# Altium schematic sheet Sheet1.SchDoc
size A2; SheetNumber: 1; SheetTotal: 1
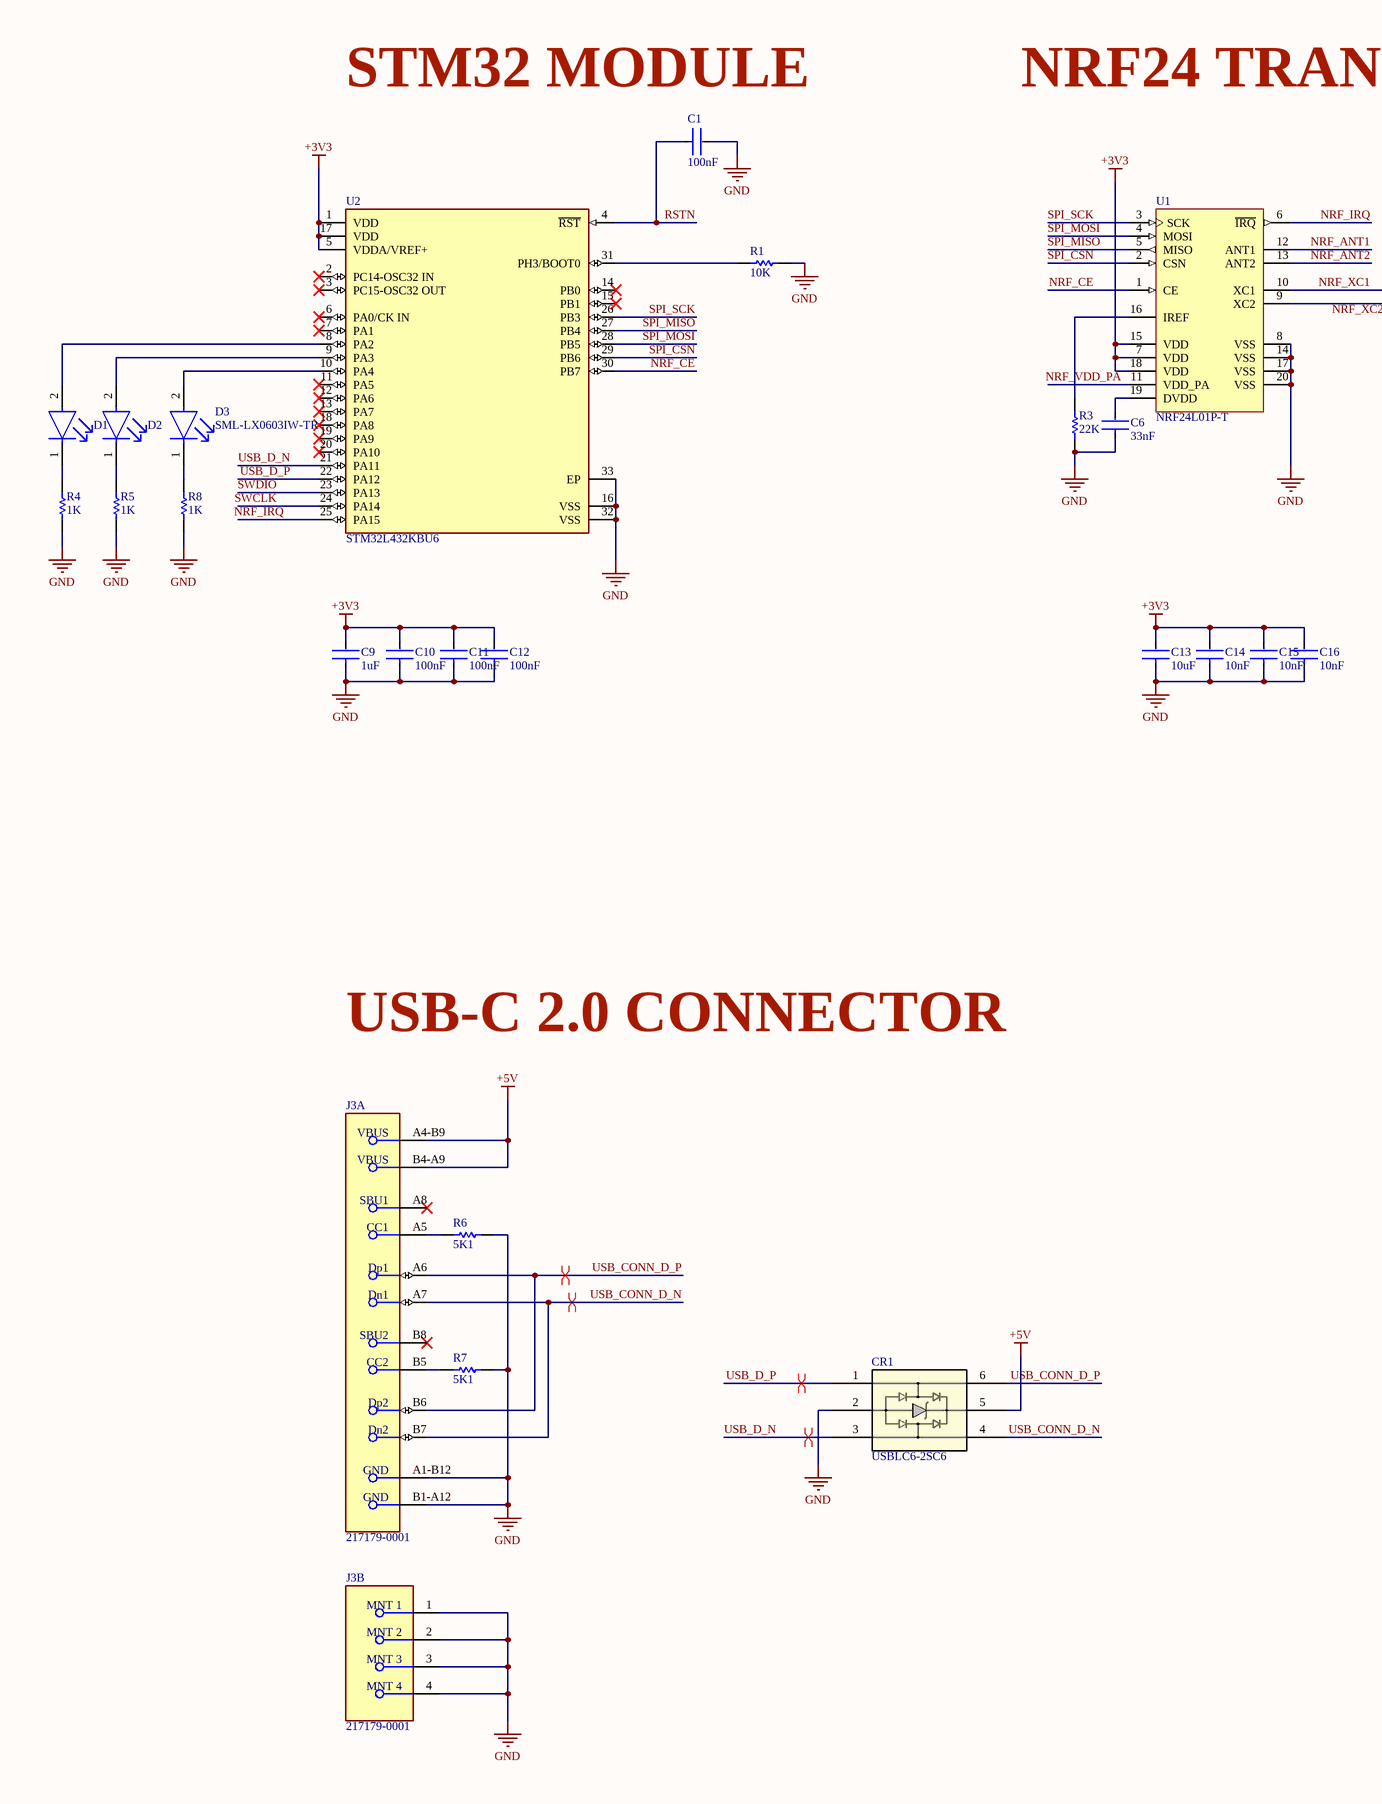
[diagram p0: Sheet1.SchDoc, left]
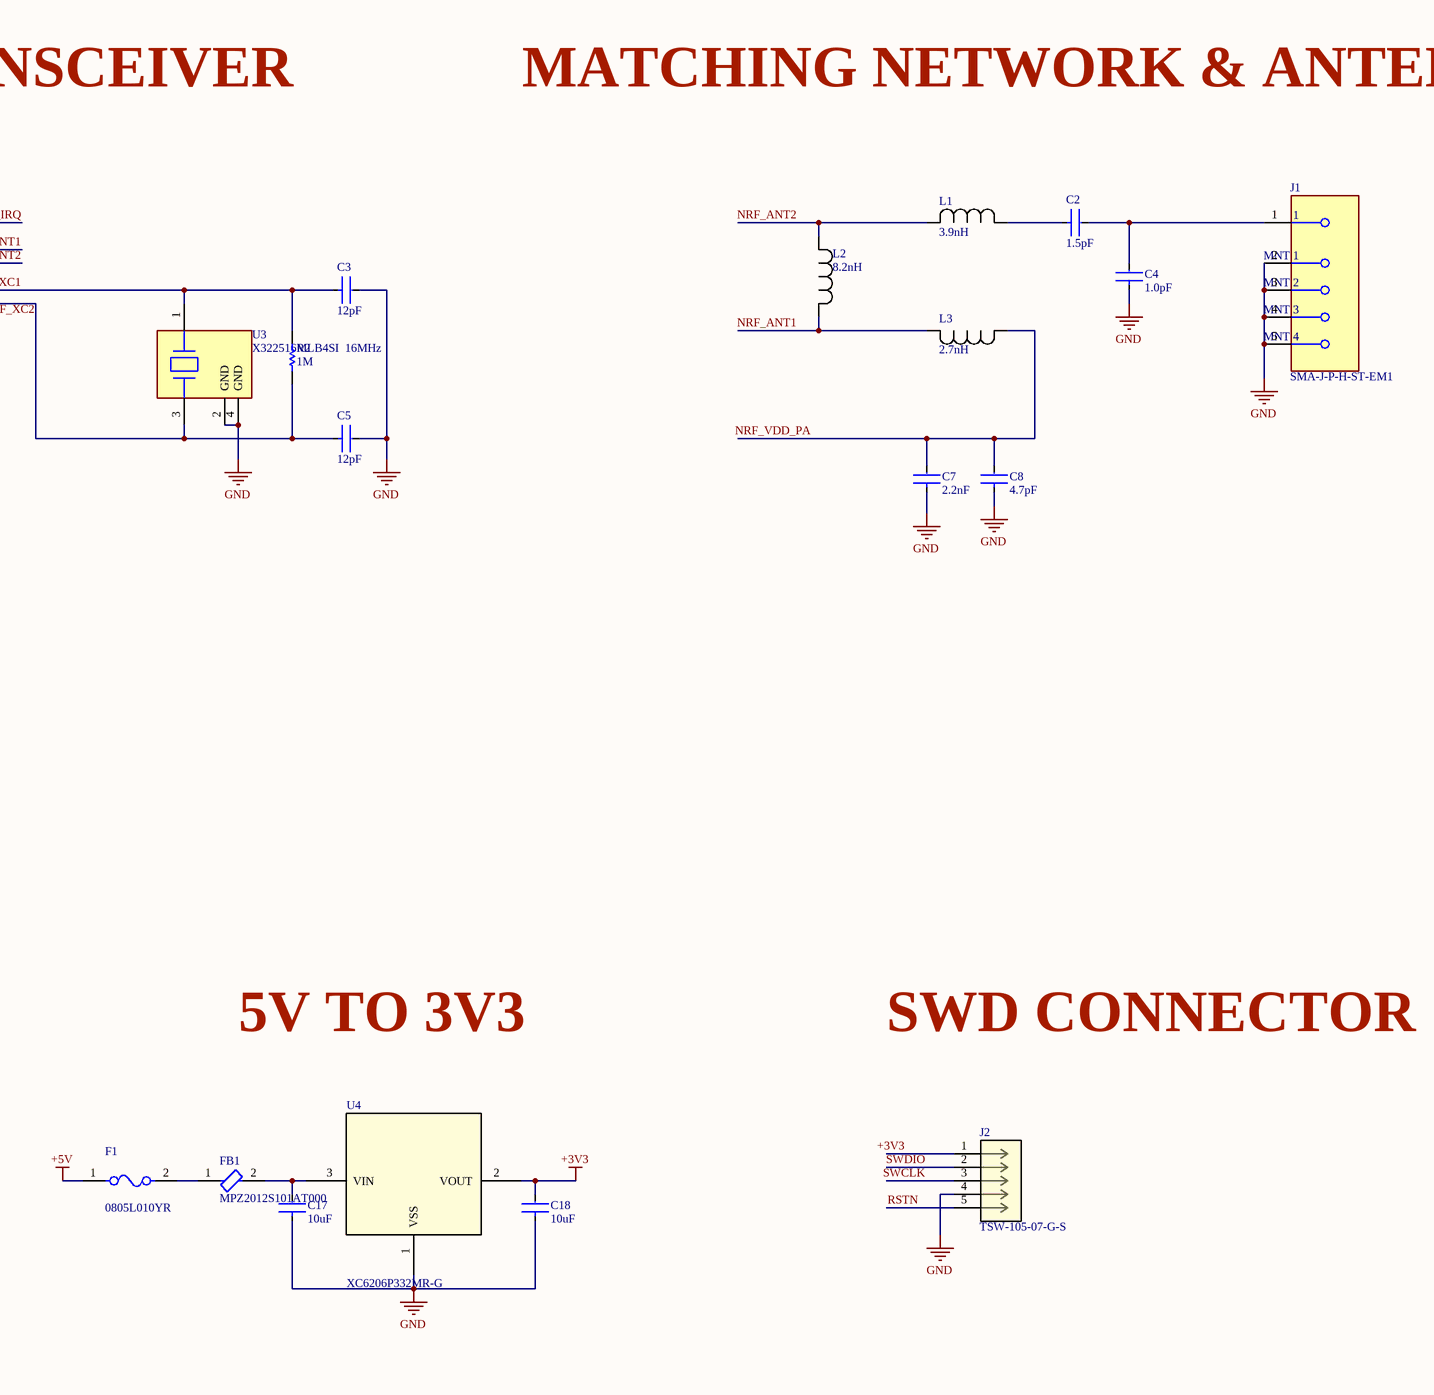
[diagram p1: Sheet1.SchDoc, right]

## Parts
C1  100nF  [CAPC1005X55N]
C2  1.5pF  [CAPC1005X55N]
C3  12pF  [CAPC1005X55N]
C4  1.0pF  [CAPC1005X55N]
C5  12pF  [CAPC1005X55N]
C6  33nF  [CAPC1005X55N]
C7  2.2nF  [CAPC1005X55N]
C8  4.7pF  [CAPC1005X55N]
C9  1uF  [CAPC1005X55N]
C10  100nF  [CAPC1005X55N]
C11  100nF  [CAPC1005X55N]
C12  100nF  [CAPC1005X55N]
C13  10uF  [CAPC1608X90]
C14  10nF  [CAPC1005X55N]
C15  10nF  [CAPC1005X55N]
C16  10nF  [CAPC1005X55N]
C17  10uF  [CAPC1608X90]
C18  10uF  [CAPC1608X90]
CR1  USBLC6-2SC6  [SOT23-6L_STM]
D1  SML-LX0603IW-TR  [FP-SML-LX0603IW-TR-MFG]  (value not drawn)
D2  SML-LX0603IW-TR  [FP-SML-LX0603IW-TR-MFG]  (value not drawn)
D3  SML-LX0603IW-TR  [FP-SML-LX0603IW-TR-MFG]
F1  0805L010YR  [FP-0805L010-MFG]
FB1  MPZ2012S101AT000  [FP-MPZ2012-IPC_A]
J1  SMA-J-P-H-ST-EM1  [FP-SMA-J-P-H-ST-EM1-MFG]
J2  TSW-105-07-G-S  [CON5_1X5_TU_TSW]
J3  217179-0001  [FP-2171790001-MFG]  (parts A,B of 2)
L1  3.9nH  [IND_LQG15HS3N3S02D_MUR]
L2  8.2nH  [IND_LQG15HS3N3S02D_MUR]
L3  2.7nH  [IND_LQG15HS3N3S02D_MUR]
R1  10K  [RESC1005X37N]
R2  1M  [RESC1005X37N]
R3  22K  [RESC1005X37N]
R4  1K  [RESC1608X55N]
R5  1K  [RESC1608X55N]
R6  5K1  [RESC1005X37N]
R7  5K1  [RESC1005X37N]
R8  1K  [RESC1608X55N]
U1  NRF24L01P-T  [NRSC-QFN-20_L]
U2  STM32L432KBU6  [FP-UFQFPN32-A0B8-MFG]
U3  X322516MLB4SI  16MHz  [CHIP_X32B4SI_SYX]
U4  XC6206P332MR-G  [SOT-23_TOR]

## Nets
+3V3: C9.2 C10.2 C11.2 C12.2 C13.2 C14.2 C15.2 C16.2 C18.2 J2.1 U1.7(VDD) U1.15(VDD) U1.18(VDD) U2.1(VDD) U2.5(VDDA/VREF+) U2.17(VDD) U4.2(VOUT)
+5V: CR1.5 F1.1 J3.A4-B9(VBUS) J3.B4-A9(VBUS)
GND: C1.2 C3.2 C4.1 C5.2 C6.1 C7.1 C8.1 C9.1 C10.1 C11.1 C12.1 C13.1 C14.1 C15.1 C16.1 C17.1 C18.1 CR1.2 J1.2(MNT_1) J1.3(MNT_2) J1.4(MNT_3) J1.5(MNT_4) J2.4 J3.1(MNT_1) J3.2(MNT_2) J3.3(MNT_3) J3.4(MNT_4) J3.A1-B12(GND) J3.B1-A12(GND) R1.2 R3.1 R4.1 R5.1 R6.2 R7.2 R8.1 U1.8(VSS) U1.14(VSS) U1.17(VSS) U1.20(VSS) U2.16(VSS) U2.32(VSS) U2.33(EP) U3.2(GND) U3.4(GND) U4.1(VSS)
NRF_ANT1: L2.1 L3.2 U1.12(ANT1)
NRF_ANT2: L1.2 L2.2 U1.13(ANT2)
NRF_CE: U1.1(CE) U2.30(PB7)
NRF_IRQ: U1.6(~{IRQ}) U2.25(PA15)
NRF_VDD_PA: C7.2 C8.2 L3.1 U1.11(VDD_PA)
NRF_XC1: C3.1 R2.2 U1.10(XC1) U3.1
NRF_XC2: C5.1 R2.1 U1.9(XC2) U3.3
RSTN: C1.1 J2.5 U2.4(~{RST})
SPI_CSN: U1.2(CSN) U2.29(PB6)
SPI_MISO: U1.5(MISO) U2.27(PB4)
SPI_MOSI: U1.4(MOSI) U2.28(PB5)
SPI_SCK: U1.3(SCK) U2.26(PB3)
SWCLK: J2.3 U2.24(PA14)
SWDIO: J2.2 U2.23(PA13)
USB_CONN_D_N: CR1.4 J3.A7(Dn1) J3.B7(Dn2)
USB_CONN_D_P: CR1.6 J3.A6(Dp1) J3.B6(Dp2)
USB_D_N: CR1.3 U2.21(PA11)
USB_D_P: CR1.1 U2.22(PA12)
NetC2_1: C2.1 L1.1
NetC2_2: C2.2 C4.2 J1.1
NetC6_2: C6.2 U1.19(DVDD)
NetC17_2: C17.2 FB1.2 U4.3(VIN)
NetD1_1: D1.1(C) R4.2
NetD1_2: D1.2(A) U2.8(PA2)
NetD2_1: D2.1(C) R5.2
NetD2_2: D2.2(A) U2.9(PA3)
NetD3_1: D3.1(C) R8.2
NetD3_2: D3.2(A) U2.10(PA4)
NetF1_2: F1.2 FB1.1
NetJ3_A5: J3.A5(CC1) R6.1
NetJ3_B5: J3.B5(CC2) R7.1
NetR1_1: R1.1 U2.31(PH3/BOOT0)
NetR3_2: R3.2 U1.16(IREF)

Not connected (* = marked no-connect by the designer): J3 A8(SBU1)* B8(SBU2)*; U2 2(PC14-OSC32_IN)* 3(PC15-OSC32_OUT)* 6(PA0/CK_IN)* 7(PA1)* 11(PA5)* 12(PA6)* 13(PA7)* 14(PB0)* 15(PB1)* 18(PA8)* 19(PA9)* 20(PA10)*

## Layout directives
differential pair: USB_CONN_D_N, USB_CONN_D_P, USB_D_N, USB_D_P

## Notes on the sheet
- (near C1) STM32 MODULE
- NRF24 TRANSCEIVER
- MATCHING NETWORK & ANTENNA
- USB-C 2.0 CONNECTOR
- 5V TO 3V3
- SWD CONNECTOR

## Library data of the parts
C1 C10-C12 = CAP-0402-100NF: Chip Capacitor, 100 nF; Case Size/Dimension: 0402; Capacitance: 100nF; LCSC Part #: C1525
C2 = CAP-0402-1P5F: Chip Capacitor, 1.5 pF; Capacitance: 1P5F; Case Size/Dimension: 0402; LCSC Part #: C76901
C3 C5 = CAP-0402-12PF: Chip Capacitor, 12 pF; Case Size/Dimension: 0402; Capacitance: 12pF; LCSC Part #: C2235030
C4 = CAP-0402-1PF: Chip Capacitor, 1.0 pF; Capacitance: 1pF; Case Size/Dimension: 0402; LCSC Part #: C76898
C6 = CAP-0402-33NF: Chip Capacitor, 33 nF; Case Size/Dimension: 0402; Capacitance: 33nF; LCSC Part #: C126535
C7 = CAP-0402-2N2F: Chip Capacitor, 2.2 nF; Capacitance: 2N2F; Case Size/Dimension: 0402; LCSC Part #: C2987940
C8 = CAP-0402-4P7F: Chip Capacitor, 4.7 pF; Capacitance: 4P7F; Case Size/Dimension: 0402; LCSC Part #: C161327
C9 = CAP-0402-1UF: Chip Capacitor, 1 uF; Case Size/Dimension: 0402; Capacitance: 1uF; LCSC Part #: C52923
C13 C17 C18 = CAP-0603-10UF: Chip Capacitor, 10 uF; Case Size/Dimension: 0603; Capacitance: 10uF; LCSC Part #: C22418930
C14-C16 = CAP-0402-10NF: Chip Capacitor, 10 nF; Case Size/Dimension: 0402; Capacitance: 10nF; LCSC Part #: C15195
CR1 = USBLC6-2SC6: ESD Protection for USB 2.0 High Speed; Manufacturer_Name: STMicroelectronics; Copyright: Copyright (C) 2025 Ultra Librarian. All rights reserved.; Manufacturer_Part_Number: USBLC6-2SC6; RefDes: RefDes; LCSC Part #: C5261088
D1-D3 = SML-LX0603IW-TR: LED RED DIFFUSED SMD; Luminous Intensity: 14mcd; Test Current: 20mA; Viewing Angle: 160°; Approvals: UL; Forward Voltage: 2V; Power Dissipation: 50mW; Dominant Wavelength: 635nm; Number of LEDs: 1; Lens Color: White; Height: 0.6mm; RoHS Compliant: Yes; Lead Free: Lead Free; Number of Pins: 2; Packaging: Tape and Reel; Case/Package: 0603; Length: 1.6mm; Color: Red; Max Operating Temperature: 85°C; Illumination Color: Red; Case Code (Metric): 1608; Diameter: 0.061inch; Min Operating Temperature: -25°C; Lens Style: Diffused; Mount: Surface Mount; Width: 0.8mm; Case Code (Imperial): 0603; Lens Transparency: Diffused; Wavelength: 635nm; Package Quantity: 1; Forward Current: 20mA; LCSC Part #: C5354817
F1 = 0805L010YR: 0805L010YR PTC Resettable Fuse 0.1A(hold) 0.3A(trip) 15VDC 100A 0.5W 1.5s 1Ohm SMD Solder Pad 0805 T/R; NexarPartId: 673855; Minimum Resistance Initial (Rmin): 1Ω; Maximum Resistance 1 Hour (R1max): 6Ω; Power Dissipation: 500mW; Working Voltage: 15V; Hold Current: 100mA; Trip Current: 300mA; Approvals: TUV, cULus; Min Operating Temperature: -40°C; Max Current Rating: 100A; Case Code (Imperial): 0805; Termination: SMD/SMT; Height: 1mm; Resistance: 6Ω; Case Code (Metric): 2012; Lifecycle Status: Production; Operating Supply Voltage: 15V; Mount: Surface Mount; Voltage Rating: 15V; RoHS: Compliant; Width: 1.5mm; Length: 2.2mm; Voltage Rating (DC): 15V; Time to Trip: 1.5s; Ambient Temperature Range High: 85°C; Max Power Dissipation: 500mW; Lead Free: Lead Free; Max Operating Temperature: 85°C; Current Rating: 100A; Terminal Material: Copper; Packaging: Cut Tape; REACH SVHC: No SVHC; Max Voltage Rating (DC): 15V; Case/Package: 0805; LCSC Part #: C207020
FB1 = MPZ2012S101AT000: FERRITE BEAD 100 OHM 0805 1LN; Impedance: 100R; DC Resistance (DCR): 20mR; Tolerance: 25%; Current Rating: 4A; Test Frequency: 100MHz; Case Code (Imperial): 0805; RoHS Compliant: Yes; REACH SVHC: No SVHC; Length: 0.079inch; Case/Package: 0805; Case Code (Metric): 2012; Mount: Surface Mount; Width: 0.049inch; Lead Free: Lead Free; Termination: SMD/SMT; Min Operating Temperature: -55°C; Package Quantity: 4000; Height: 0.041inch; Max Operating Temperature: 125°C; Weight: 0.000194oz; Max DC Current: 4A; Packaging: Tape and Reel; LCSC Part #: C15957
J1 = SMA-J-P-H-ST-EM1: CONN SMA JACK STR 50OHM EDGE MNT; Dielectric Material: PTFE; Center Contact Plating: Gold; Max Frequency: 6GHz; Body Material: Brass; Voltage Rating: 335V; Impedance: 50R; Package Quantity: 1; Case/Package: SMA; Max Operating Temperature: 125°C; Fastening Type: Threaded; Orientation: Straight; Depth: 13.33mm; RoHS Compliant: Yes; Length: 6.35mm; Insulation Material: Polytetrafluoroethylene; Termination: Solder; Min Operating Temperature: -65°C; Housing Color: Gold; Contact Plating: Gold; Contact Material: Copper; Connector Type: SMA; Mount: Edge; Series: SMA; Packaging: Tray; Body Plating: Gold; Radiation Hardening: No; LCSC Part #: C5199907
J2 = TSW-105-07-G-S: Conn Unshrouded Header HDR 5 POS 2.54mm Solder ST Top Entry Thru-Hole Bag; Manufacturer_Name: Samtec Inc; Copyright: Copyright (C) 2025 Ultra Librarian. All rights reserved.; Manufacturer_Part_Number: TSW-105-07-G-S; RefDes: RefDes; Type: Type; LCSC Part #: C5993812
J3 = 217179-0001: CONN RCP USB2.0 TYP C 24P SMD RA; NexarPartId: 117190526; Gender: Receptacle; Number of Contacts: 16; Current Rating: 1.25A; Voltage Rating: 30V; Min Operating Temperature: -40°C; USB Standard: USB 2.0; Height: 3.36mm; Contact Material: Gold, Nickel; Max Operating Temperature: 85°C; LCSC Part #: C3197684
L1 = IND SMD 3.9nH: Inductor SMD; Copyright: Copyright (C) 2026 Ultra Librarian. All rights reserved.; LCSC Part #: C77109
L2 = IND SMD 8.2nH: Inductor SMD; Copyright: Copyright (C) 2026 Ultra Librarian. All rights reserved.; LCSC Part #: C98003
L3 = IND SMD 2.7nH: Inductor SMD; Copyright: Copyright (C) 2026 Ultra Librarian. All rights reserved.; LCSC Part #: C77108
R1 = RES-0402-10K: RES 10kΩ ±1% 62.5mW 0402; Resistance: 10kR; Composition: Thin Film; Case/Package: 0402; LCSC Part #: C60490
R2 = RES-0402-1M: RES 1MΩ ±1% 62.5mW 0402; Resistance: 1MR; Composition: Thin Film; Case/Package: 0402; LCSC Part #: C2906900
R3 = RES-0402-22K: RES 22kΩ ±1% 62.5mW 0402; Resistance: 22kR; Composition: Thin Film; Case/Package: 0402; LCSC Part #: C82868
R4 R5 R8 = RES-0603-1K: RES 1KΩ ±1% 62.5mW 0603; Resistance: 1KR; Composition: Thin Film; Case/Package: 0603; LCSC Part #: C2907002
R6 R7 = RES-0402-5K1: RES 5K1Ω ±1% 62.5mW 0402; Resistance: 5K1R; Composition: Thin Film; Case/Package: 0402; LCSC Part #: C723526
U1 = NRF24L01P-T: Single Chip Transceiver, 2.4 GHz, 60 mW, 1.9 to 3.6 V, -40 to 85 degC, 20-Pin QFN, RoHS, Tray; Manufacturer: Nordic Semiconductor; Data Rate (Max): 2Mbps; Current - Transmitting: 7mA~11.3mA; Power - Output: 0dBm; Other Names: 1490-1019; Online Catalog: nRF24L01+; Current - Receiving: 12.6mA~13.5mA; For Use With: 1490-1002-ND-KITEVALUATIONNRF24L01P1568-1295-ND-SPARKFUNTRANSCEIVERBREAKOUT-1568-1296-ND-SPARKFUNTRANSCEIVERBREAKOUT-1471-1410-ND-DEVBOARDNRFSCLICKNRF24L01P-MODULE-PCB-ND-KITEVALNRF24L01+PCBANTENNANRF24L01P-MODULE-SMA-ND-KITEVALNRF24L01+SMACONNNRF24L01P-UPGRADE-ND-UPGRADE2PCB/1SMANRF24L01103990038-ND-DEVDUINOSENSORNODEV1.3103990053-ND-DEVDUINOSENSORNODEV2(ATMEGA103990074-ND-DEVDUINOSENSORNODE106990026-ND-ENERGYMONITORSHIELDV2113990088-ND-WIRELESSGATESHIELD113990095-ND-DEVDUINOSENSORNODEV3(ATMEGA106030001-ND-ENERGYMONITORSHIELD1597-1361-ND-DEVDUINOSENSORNODEV2.2(ATMEG105990030-ND-RGBWSTRIPWIRELESSSHIELDV1.0; Frequency: 2.4GHz; Design Resources: DevelopmentToolSelector; RF Family/Standard: GeneralISM>1GHZ; Serial Interfaces: SPI; Sensitivity: -94dBm; Voltage - Supply: 1.9V~3.6V; Modulation: GFSK; GPIO: -; Package Reference: QFN20; Memory Size: -; Category: RF/IFandRFID; Type: TxRxOnly; Standard Package: 490; Package / Case: 20-VFQFNExposedPad; Packaging: Tray; Series: -; Package Description: 20-Pin Quad Flat No-lead Package, Body 4 x 4 mm, Pitch 0.5 mm; Datasheet Version: Rev. 1.0, 09/2008; Protocol: -; Manufacturer URL: http://www.nordicsemi.com/eng/Products/; Operating Temperature: -40°C~85°C; Family: RFTransceiverICs; Datasheet URL: http://www.nordicsemi.com/eng/content/download/2726/34069/file/nRF24L01P_Product_Specification_1_0.pdf; Mounting Technology: SurfaceMount; LCSC Part #: C1526140
U2 = STM32L432KBU6: IC MCU 32BIT 128KB FLASH 32QFPN; Manufacturer: STMicroelectronics; Memory Size: 128KBytes; Number Of I/Os: 26; Max Supply Voltage: 3.6V; Core Architecture: ARM Cortex-M4; Number Of A/D Converters: 1; Number Of Timers/Counters: 8; Min Supply Voltage: 1.62V; Interface: I2C,SPI,UART,USART,USB,IrDA; Number Of Spi Channels: 2; Frequency: 80MHz; Max Junction Temp: +105°C; Number Of Adc Channels: 10; Ram Size: 64KBytes; Data Bus Width: 32bits; Ambient Temperature Range High: +85°C; Device Class L2: Embedded Processors and Controllers; Temperature: -40°C to +85°C; Category: IC; ComponentLink2URL: https://www.st.com/resource/en/datasheet/stm32l432kb.pdf; Device Class L1: Integrated Circuits (ICs); ComponentLink2Description: Datasheet; Memory Type: FLASH; Ipc Land Pattern Name: QFN50P500X500X55-32; Temperature Range Low: -40°C; Height: 0.6mm; Digikey Description: IC MCU 32BIT 128KB FLASH 32QFPN; Temperature Range High: +85°C; Device Class L3: Microcontrollers; Lead Free: Yes; RoHS: TRUE; Octopart: https://octopart.com/stm32l432kbu6-stmicroelectronics-74568735; Manufacturer Part Number: STM32L432KBU6; Number Of Uart Channels: 1; Ambient Temperature Range Low: -40°C; Package: UFQFPN32-A0B8; Number Of I2C Channels: 2; Number Of Cores: 1; Automotive: No; LCSC Part #: C94784
U3 = X322516MLB4SI: CRYSTAL 16MHz 9pF SMD; Manufacturer_Name: Shenzhen Yang Xing Technology; Copyright: Copyright (C) 2025 Ultra Librarian. All rights reserved.; Manufacturer_Part_Number: X322516MLB4SI; RefDes: RefDes; Type: Type; LCSC Part #: C13738
U4 = XC6206P332MR-G: Low ESR Cap. Compatible Positive Voltage Regulators; Manufacturer_Name: Torex Semiconductor; Copyright: Copyright (C) 2026 Ultra Librarian. All rights reserved.; Manufacturer_Part_Number: XC6206P332MR-G; RefDes: RefDes; Type: Type; LCSC Part #: C5446